# Altium project PCB_Project_CDC_emu_ALPINE.PrjPcb
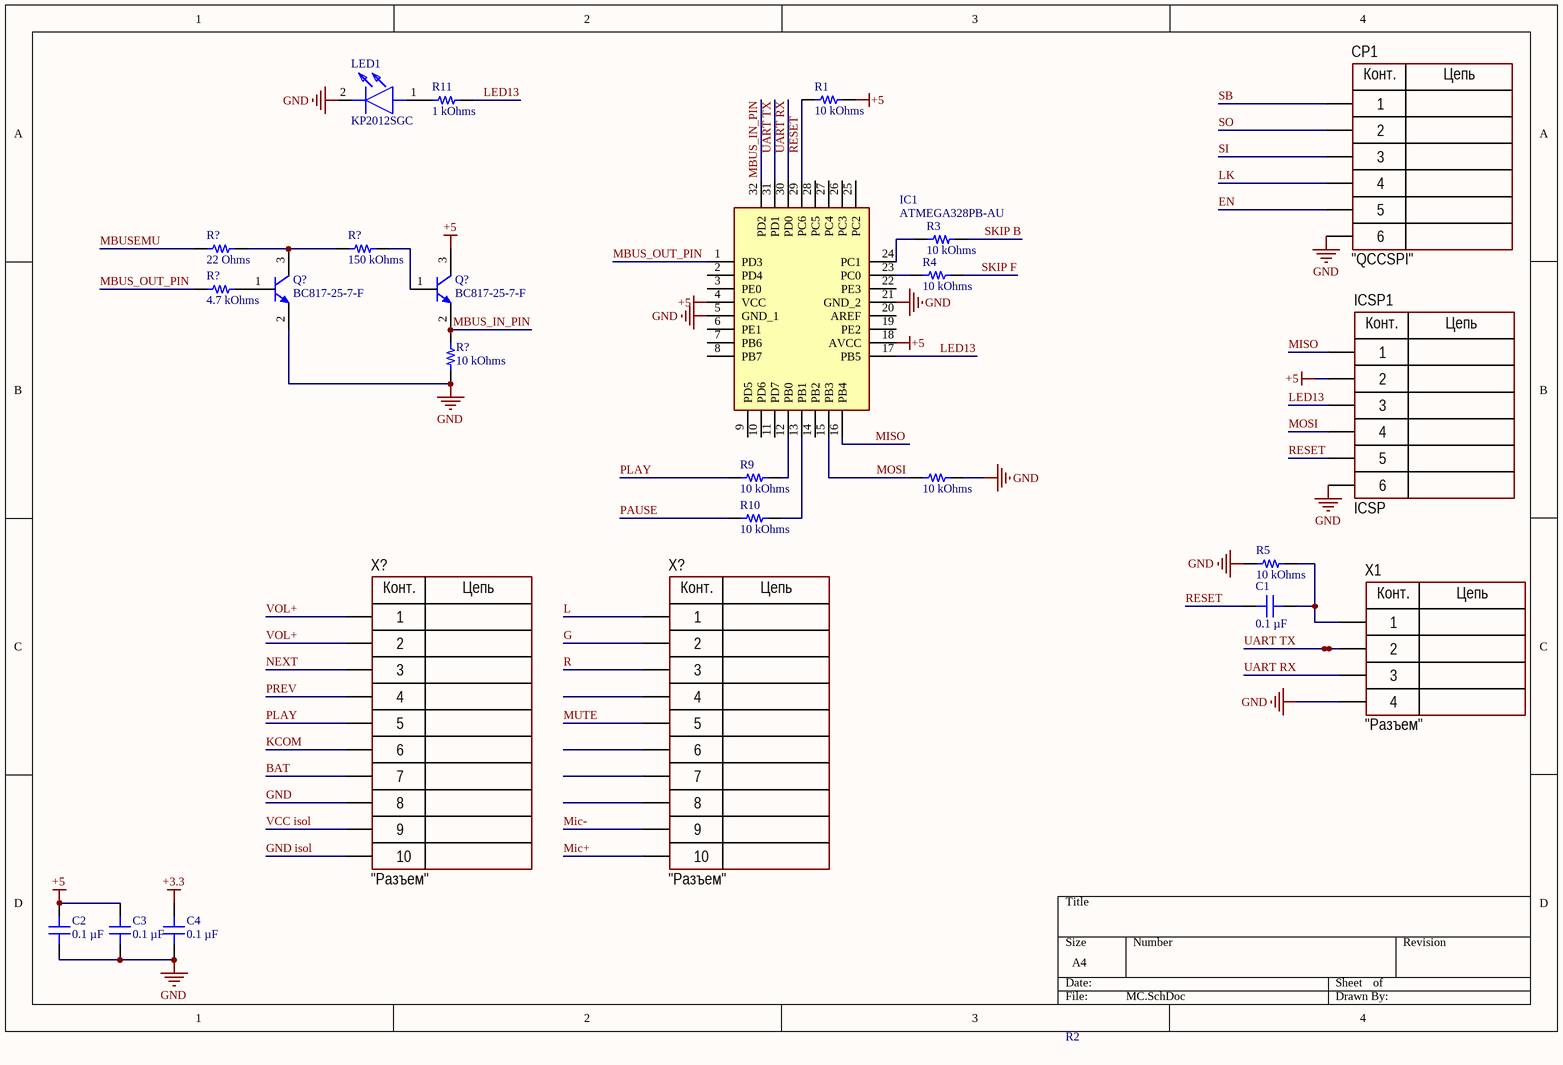
[diagram p0: MC.SchDoc]
1 sheet, 25 parts. Net scope: global (net labels, ports and power ports of the same name join across sheets).
Board file: PCB_СDC_emu_ALPINE.PcbDoc

## Sheet MC.SchDoc
size A4; SheetNumber: 1; SheetTotal: 1

### Parts
(Parts that share a designator on the sheet are numbered #1, #2 ... from top to bottom, then left to right.)
C1  0.1 µF  [CAP 0603_1608]
C2  0.1 µF  [CAP 0603_1608]
C3  0.1 µF  [CAP 0603_1608]
C4  0.1 µF  [CAP 0603_1608]
CP1  CommentText: "QCCSPI"  [CON: PLS-6]
IC1  ATMEGA328PB-AU  [QFP80P900X900X120-32N]
ICSP1  CommentText: ICSP  [CON: PBD-6]
LED1  KP2012SGC  [KP2012SGC]
Q?#1  BC817-25-7-F  [DIODES SOT-23-3]
Q?#2  BC817-25-7-F  [DIODES SOT-23-3]
R1  10 kOhms  [YAGEO RES 0603_1608]
R2  10 kOhms  [YAGEO RES 0603_1608]
R3  10 kOhms  [YAGEO RES 0603_1608]
R4  10 kOhms  [YAGEO RES 0603_1608]
R5  10 kOhms  [YAGEO RES 0603_1608]
R9  10 kOhms  [YAGEO RES 0603_1608]
R10  10 kOhms  [YAGEO RES 0603_1608]
R11  1 kOhms  [YAGEO RES 0603_1608]
R?#1  22 Ohms  [YAGEO RES 0603_1608]
R?#2  150 kOhms  [YAGEO RES 0603_1608]
R?#3  4.7 kOhms  [YAGEO RES 0603_1608]
R?#4  10 kOhms  [YAGEO RES 0603_1608]
X1  CommentText: "Разъем"  [CON: PLS-4]
X?#1  CommentText: "Разъем"  [CON: PLS-10]
X?#2  CommentText: "Разъем"  [CON: PLS-10]

### Nets
+3.3: C4.2
+5: C2.2 C3.2 IC1.4(VCC) IC1.18(AVCC) ICSP1.2 Q?#2.3(C) R1.2
GND: C2.1 C3.1 C4.1 CP1.6 IC1.5(GND_1) IC1.21(GND_2) ICSP1.6 LED1.2(K) Q?#1.2(E) R2.2 R5.1 R?#4.1 X1.4 X?#1.8
BAT: X?#1.7
EN: CP1.5
G: X?#2.2
GND isol: X?#1.10
KCOM: X?#1.6
L: X?#2.1
LED13: IC1.17(PB5) ICSP1.3 R11.2
LK: CP1.4
MBUS_IN_PIN: IC1.32(PD2) Q?#2.2(E) R?#4.2
MBUS_OUT_PIN: IC1.1(PD3) R?#3.1
MBUSEMU: R?#1.1
Mic+: X?#2.10
Mic-: X?#2.9
MISO: IC1.16(PB4) ICSP1.1
MOSI: IC1.15(PB3) ICSP1.4 R2.1
MUTE: X?#2.5
NEXT: X?#1.3
PAUSE: R10.1
PLAY: R9.1 X?#1.5
PREV: X?#1.4
R: X?#2.3
RESET: C1.2 IC1.29(PC6) ICSP1.5 R1.1
SB: CP1.1
SI: CP1.3
SKIP B: R3.2
SKIP F: R4.2
SO: CP1.2
UART RX: IC1.30(PD0) X1.3
UART TX: IC1.31(PD1) X1.2
VCC isol: X?#1.9
VOL+: X?#1.1 X?#1.2
NetC1_1: C1.1 R5.2 X1.1
NetIC1_12: IC1.12(PB0) R9.2
NetIC1_13: IC1.13(PB1) R10.2
NetIC1_23: IC1.23(PC0) R4.1
NetIC1_24: IC1.24(PC1) R3.1
NetLED1_1: LED1.1(A) R11.1
NetQ?#1_1: Q?#1.1(B) R?#3.2
NetQ?#1_3: Q?#1.3(C) R?#1.2 R?#2.1
NetQ?#2_1: Q?#2.1(B) R?#2.2

Not connected (* = marked no-connect by the designer): IC1 2(PD4) 3(PE0) 6(PE1) 7(PB6) 8(PB7) 9(PD5) 10(PD6) 11(PD7) 14(PB2) 19(PE2) 20(AREF) 22(PE3) 25(PC2) 26(PC3) 27(PC4) 28(PC5); X?#2 4 6 7 8

### Notes on the sheet
- (in symbol PBD-6) Конт.; Цепь
- (in symbol PLS-4) Конт.; Цепь
- (in symbol PLS-6) Конт.; Цепь
- (in symbol PLS-10) Конт.; Цепь

### Library data of the parts
C1-C4 = CC0603KRX7R7BB104: CAP CER 0.1UF 16V X7R 0603; manufacturer: Yageo; Tolerance: ±10%; Part Number: CC0603KRX7R7BB104; Value: 0.1 µF; Applications: General Purpose; Capacitance: 0.1 µF; componentlink1description: Datasheet; componentlink1url: https://www.yageo.com/upload/media/product/productsearch/datasheet/mlcc/UPY-GPHC_X7R_6.3V-to-50V_18.pdf; componentlink2description: DigiKey Link; componentlink2url: https://www.digikey.com/en/products/detail/yageo/CC0603KRX7R7BB104/302822; Device Package: 0603 (1608 Metric); lastupdated: 09.02.2024 20:10:09; Lifecycle Status: Active; Minimum Order: 1; Mounting Type: Surface Mount, MLCC; Operating Temperature: -55°C ~ 125°C; Package / Case: 0603 (1608 Metric); packaging: TapeAndReel; partid: 16746; Part Status: Active; price: 0.01; series: CC; Size / Dimension: 0.063" L x 0.031" W (1.60mm x 0.80mm); Supplier 1: DigiKey; Supplier Part Number 1: 311-1088-1-ND; Temperature Coefficient: X7R; Thickness (Max): 0.035" (0.90mm); Voltage - Rated: 16V
CP1 = PLS-6: Manufacturer: Connfly; ValueManufacturerPartNumber: Connector, 6pin, 2.54mm, 500VAC, 3A; TypeConnector: Connector; VoltageMax: 500VAC; Pitch: 2.54mm; CurrentMax: 3A; Multichannel: 6pin; HelpURL: https://www.chipdip.ru/product/pls-6; PartNumber: PLS-6
IC1 = ATMEGA328PB-AU: Integrated Circuit; Manufacturer_Name: Microchip; Datasheet Link: http://www.farnell.com/datasheets/2014286.pdf; Height: 1.2mm; Manufacturer_Part_Number: ATMEGA328PB-AU; Mouser Part Number: 556-ATMEGA328PB-AU; Mouser Price/Stock: https://www.mouser.co.uk/ProductDetail/Microchip-Technology/ATMEGA328PB-AU?qs=jy4bLUHv09hbFONgGrqPbw%3D%3D; Arrow Part Number: ATMEGA328PB-AU; Arrow Price/Stock: https://www.arrow.com/en/products/atmega328pb-au/microchip-technology?region=nac
ICSP1 = PBD-6: Manufacturer: Connfly; ValueManufacturerPartNumber: Connector, 6pin, 2.54mm, 500VAC, 3A; TypeConnector: Connector; VoltageMax: 500VAC; Pitch: 2.54mm; CurrentMax: 3A; Multichannel: 6pin; HelpURL: https://www.chipdip.ru/product/pbd-6; PartNumber: PBD-6
LED1 = KP2012SGC: LED; Manufacturer_Name: Kingbright; Datasheet Link: https://docs.rs-online.com/9e3e/0900766b8032fa8b.pdf; Height: 1.1mm; Manufacturer_Part_Number: KP2012SGC; Mouser Part Number: N/A; Mouser Price/Stock: https://www.mouser.co.uk/ProductDetail/Kingbright/KP2012SGC?qs=5aG0NVq1C4xgkmzx8ebWbQ%3D%3D
Q?#1 Q?#2 = BC817-25-7-F: TRANS NPN 45V 0.5A SOT23-3; Manufacturer: Diodes Incorporated; Current - Collector Cutoff (Max): 100nA; Current - Collector (Ic) (Max): 500 mA; DC Current Gain (hFE) (Min) @ Ic, Vce: 160 @ 100mA, 1V; Frequency - Transition: 100MHz; Power - Max: 310 mW; Vce Saturation (Max) @ Ib, Ic: 700mV @ 50mA, 500mA; Part Number: BC817-25-7-F; ComponentLink1Description: Datasheet; ComponentLink1URL: https://www.diodes.com/assets/Datasheets/ds11107.pdf; ComponentLink2Description: DigiKey Link; ComponentLink2URL: https://www.digikey.com/en/products/detail/diodes-incorporated/BC817-25-7-F/768871; LastUpdated: 03.06.2024 20:24:11; Lifecycle Status: Active; Minimum Order: 1; Mounting Type: Surface Mount; Operating Temperature: -65°C ~ 150°C (TJ); Package / Case: TO-236-3, SC-59, SOT-23-3; Packaging: TapeAndReel; PartId: 114; Part Status: Active; Price: 0.02; Series: -; Supplier 1: DigiKey; Supplier Part Number 1: BC817-25FDICT-ND; Supplier Device Package: SOT-23-3; Transistor Type: NPN; Voltage - Collector Emitter Breakdown (Max): 45 V
R1-R5 R9 R10 R?#4 = RC0603FR-1310KL: RES 10K OHM 1% 1/10W 0603; Manufacturer: Yageo; Power (Watts): 0.1W, 1/10W; Temperature Coefficient: ±100ppm/°C; Part Number: RC0603FR-1310KL; Value: 10 kOhms; ComponentLink1Description: Datasheet; ComponentLink1URL: https://www.yageo.com/upload/media/product/productsearch/datasheet/rchip/PYu-RC_Group_51_RoHS_L_11.pdf; ComponentLink2Description: DigiKey Link; ComponentLink2URL: https://www.digikey.com/en/products/detail/yageo/RC0603FR-1310KL/12756399; Composition: Thick Film; Device Package: 0603 (1608 Metric); Features: Moisture Resistant; Height - Seated (Max): 0.022" (0.55mm); LastUpdated: 25.07.2024 9:19:08; Lifecycle Status: Active; Minimum Order: 1; Number of Terminations: 2; Operating Temperature: -55°C ~ 155°C; Package / Case: 0603 (1608 Metric); Packaging: CutTape; PartId: 67561; Part Status: Active; Price: 0.01; Resistance: 10 kOhms; Series: RC_L; Size / Dimension: 0.063" L x 0.031" W (1.60mm x 0.80mm); Supplier 1: DigiKey; Supplier Part Number 1: 13-RC0603FR-1310KLCT-ND; Supplier Device Package: 0603; Tolerance: ±1%
R11 = RC0603FR-071KL: RES 1K OHM 1% 1/10W 0603; Manufacturer: Yageo; Power (Watts): 0.1W, 1/10W; Temperature Coefficient: ±100ppm/°C; Part Number: RC0603FR-071KL; Value: 1 kOhms; ComponentLink1Description: Datasheet; ComponentLink1URL: https://www.yageo.com/upload/media/product/productsearch/datasheet/rchip/PYu-RC_Group_51_RoHS_L_10.pdf; ComponentLink2Description: DigiKey Link; ComponentLink2URL: https://www.digikey.com/en/products/detail/yageo/RC0603FR-071KL/726843; Composition: Thick Film; Device Package: 0603 (1608 Metric); Features: Moisture Resistant; Height - Seated (Max): 0.022" (0.55mm); LastUpdated: 25.07.2024 9:19:19; Lifecycle Status: Active; Minimum Order: 1; Number of Terminations: 2; Operating Temperature: -55°C ~ 155°C; Package / Case: 0603 (1608 Metric); Packaging: CutTape; PartId: 22600; Part Status: Active; Price: 0.01; Resistance: 1 kOhms; Series: RC_L; Size / Dimension: 0.063" L x 0.031" W (1.60mm x 0.80mm); Supplier 1: DigiKey; Supplier Part Number 1: 311-1.00KHRCT-ND; Supplier Device Package: 0603; Tolerance: ±1%
R?#1 = RC0603JR-0722RL: RES 22 OHM 5% 1/10W 0603; Manufacturer: Yageo; Power (Watts): 0.1W, 1/10W; Temperature Coefficient: ±100ppm/°C; Part Number: RC0603JR-0722RL; Value: 22 Ohms; ComponentLink1Description: Datasheet; ComponentLink1URL: https://www.yageo.com/upload/media/product/productsearch/datasheet/rchip/PYu-RC_Group_51_RoHS_L_10.pdf; ComponentLink2Description: DigiKey Link; ComponentLink2URL: https://www.digikey.com/en/products/detail/yageo/RC0603JR-0722RL/726743; Composition: Thick Film; Device Package: 0603 (1608 Metric); Features: Moisture Resistant; Height - Seated (Max): 0.022" (0.55mm); LastUpdated: 25.07.2024 9:19:24; Lifecycle Status: Active; Minimum Order: 1; Number of Terminations: 2; Operating Temperature: -55°C ~ 155°C; Package / Case: 0603 (1608 Metric); Packaging: CutTape; PartId: 17085; Part Status: Active; Price: 0.01; Resistance: 22 Ohms; Series: RC_L; Size / Dimension: 0.063" L x 0.031" W (1.60mm x 0.80mm); Supplier 1: DigiKey; Supplier Part Number 1: 311-22GRCT-ND; Supplier Device Package: 0603; Tolerance: ±5%
R?#2 = RC0603FR-07150KL: RES 150K OHM 1% 1/10W 0603; Manufacturer: Yageo; Power (Watts): 0.1W, 1/10W; Temperature Coefficient: ±100ppm/°C; Part Number: RC0603FR-07150KL; Value: 150 kOhms; ComponentLink1Description: Datasheet; ComponentLink1URL: https://www.yageo.com/upload/media/product/productsearch/datasheet/rchip/PYu-RC_Group_51_RoHS_L_10.pdf; ComponentLink2Description: DigiKey Link; ComponentLink2URL: https://www.digikey.com/en/products/detail/yageo/RC0603FR-07150KL/726959; Composition: Thick Film; Device Package: 0603 (1608 Metric); Features: Moisture Resistant; Height - Seated (Max): 0.022" (0.55mm); LastUpdated: 25.07.2024 9:19:21; Lifecycle Status: Active; Minimum Order: 1; Number of Terminations: 2; Operating Temperature: -55°C ~ 155°C; Package / Case: 0603 (1608 Metric); Packaging: CutTape; PartId: 18953; Part Status: Active; Price: 0.01; Resistance: 150 kOhms; Series: RC_L; Size / Dimension: 0.063" L x 0.031" W (1.60mm x 0.80mm); Supplier 1: DigiKey; Supplier Part Number 1: 311-150KHRCT-ND; Supplier Device Package: 0603; Tolerance: ±1%
R?#3 = RC0603FR-074K7L: RES 4.7K OHM 1% 1/10W 0603; Manufacturer: Yageo; Power (Watts): 0.1W, 1/10W; Temperature Coefficient: ±100ppm/°C; Part Number: RC0603FR-074K7L; Value: 4.7 kOhms; ComponentLink1Description: Datasheet; ComponentLink1URL: https://www.yageo.com/upload/media/product/productsearch/datasheet/rchip/PYu-RC_Group_51_RoHS_L_10.pdf; ComponentLink2Description: DigiKey Link; ComponentLink2URL: https://www.digikey.com/en/products/detail/yageo/RC0603FR-074K7L/727212; Composition: Thick Film; Device Package: 0603 (1608 Metric); Features: Moisture Resistant; Height - Seated (Max): 0.022" (0.55mm); LastUpdated: 25.07.2024 9:19:17; Lifecycle Status: Active; Minimum Order: 1; Number of Terminations: 2; Operating Temperature: -55°C ~ 155°C; Package / Case: 0603 (1608 Metric); Packaging: CutTape; PartId: 23949; Part Status: Active; Price: 0.01; Resistance: 4.7 kOhms; Series: RC_L; Size / Dimension: 0.063" L x 0.031" W (1.60mm x 0.80mm); Supplier 1: DigiKey; Supplier Part Number 1: 311-4.70KHRCT-ND; Supplier Device Package: 0603; Tolerance: ±1%
X1 = PLS-4: Manufacturer: Connfly; ValueManufacturerPartNumber: Connector, 4pin, 2.54mm, 500VAC, 3A; TypeConnector: Connector; VoltageMax: 500VAC; Pitch: 2.54mm; CurrentMax: 3A; Multichannel: 4pin; HelpURL: https://www.chipdip.ru/product/pls-4; PartNumber: PLS-4
X?#1 X?#2 = PLS-10: Manufacturer: Connfly; ValueManufacturerPartNumber: Connector, 10pin, 2.54mm, 500VAC, 3A; TypeConnector: Connector; VoltageMax: 500VAC; Pitch: 2.54mm; CurrentMax: 3A; Multichannel: 10pin; HelpURL: https://www.chipdip.ru/product/pls-10; PartNumber: PLS-10